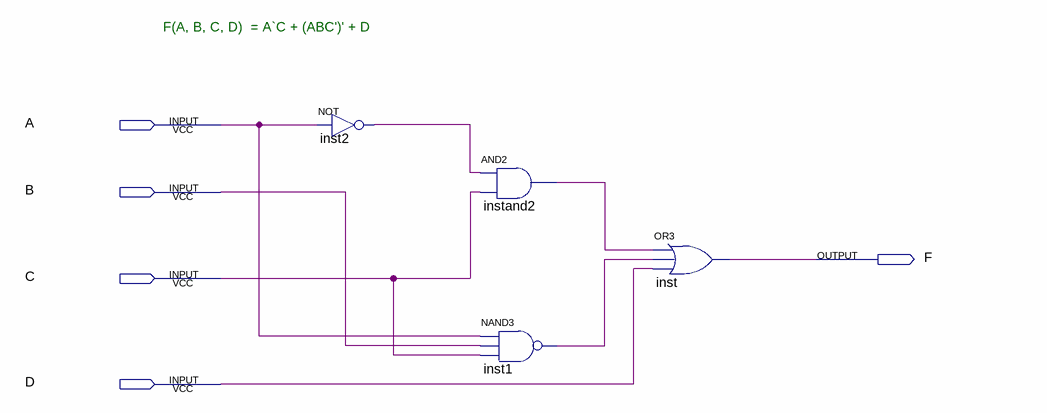
[diagram p0: schematic sheet]
// Quartus schematic Bai22_10.bdf as structural Verilog: 4 symbols, 5 pins
module Bai22_10 (
  input  A,
  input  B,
  input  C,
  input  D,
  output F
);

  wire inst1_out, inst2_out, instand2_out;

  not inst2 (inst2_out, A);
  and instand2 (instand2_out, inst2_out, C);
  nand inst1 (inst1_out, A, B, C);
  or inst (F, instand2_out, inst1_out, D);

  // Notes on the sheet:
  //   F(A, B, C, D)  = A`C + (ABC')' + D
endmodule
